# Altium schematic sheet 4_USB_TO_UART.SchDoc: 4_USB_TO_UART
size A4; ApprovedBy: Alcatraz; CheckedBy: Alcatraz; Author: Alcatraz; CompanyName: DHNLAB; DrawnBy: Alcatraz; Engineer: Alcatraz; Organization: DHNLAB PVT LTD; Address1: DHANBAD; Address2: JHARKHAND; Address3: INDIA; Address4: ASIA; DocumentNumber: 4; Revision: 1.0; SheetNumber: 4; SheetTotal: 10; ProjectTitle: ESP8266-Deskop_Power
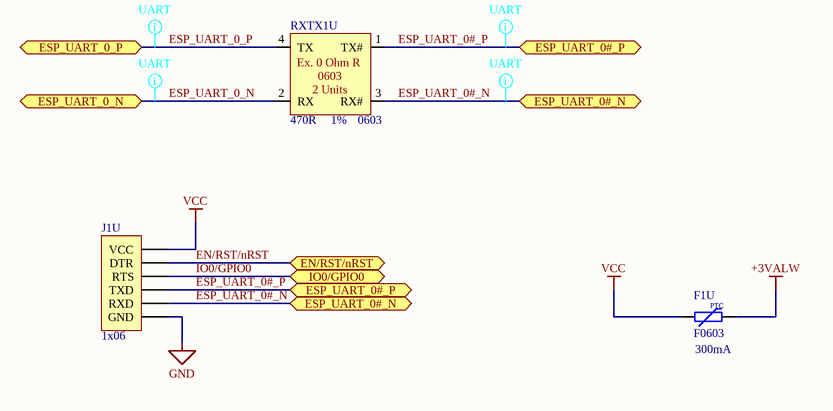
[diagram p0: 4_USB_TO_UART.SchDoc]

## Parts
F1U  F0603  value 300mA  [R0603-IPC_C]
J1U  1x06  [PinHeader_1x06_P2.54mm_Vertical_No_3D]
RXTX1U  value 470R  Tol: 1%  Package: 0603  [UART_TX_RX_0603]  (hidden comment: UART_TX_RX)

## Ports
EN/RST/nRST (bidir), ESP_UART_0#_N (bidir, see 4_ESP32-Core[3B]), ESP_UART_0#_P (bidir, see 4_ESP32-Core[3B]), ESP_UART_0_N (bidir, see 4_ESP32-Core[3B]), ESP_UART_0_P (bidir, see 4_ESP32-Core[3B]), IO0/GPIO0 (bidir)

## Nets
+3VALW: F1U.2
GND: J1U.1(GND)
VCC: F1U.1 J1U.6(VCC)
EN/RST/nRST: J1U.5(DTR) ; port EN/RST/nRST
ESP_UART_0#_N: J1U.2(RXD) RXTX1U.3(RX#) ; port ESP_UART_0#_N
ESP_UART_0#_P: J1U.3(TXD) RXTX1U.1(TX#) ; port ESP_UART_0#_P
ESP_UART_0_N: RXTX1U.2(RX) ; port ESP_UART_0_N
ESP_UART_0_P: RXTX1U.4(TX) ; port ESP_UART_0_P
IO0/GPIO0: J1U.4(RTS) ; port IO0/GPIO0

## Layout directives
differential pair; differential pair class UART: ESP_UART_0#_N, ESP_UART_0#_P, ESP_UART_0_N, ESP_UART_0_P

## Notes on the sheet
- Title:
- Author:
- Approved:
- Size:
- Date:
- Git Hash:
- A4
- Prj:
- SW Version:
- Variant:
- Edited:
- PUBLIC
- File:
- (in symbol FUSE_PPTC_0603) PTC
- (in symbol UART_TX_RX_0603) Ex. 0 Ohm R / 0603 / 2 Units /

## Library data of the parts
F1U = FUSE_PPTC_0603: Fuse PPTC SMD 0603; Manufacturer: *; Manufacturer Part Number: *
J1U = UART_1X06_P2.54mm_2
RXTX1U = UART_TX_RX_0603: UART RX/TX Pokayoke; Type: Jumper-Swap